# Altium schematic sheet Lora module.SchDoc
size A; SheetNumber: 2; SheetTotal: 3
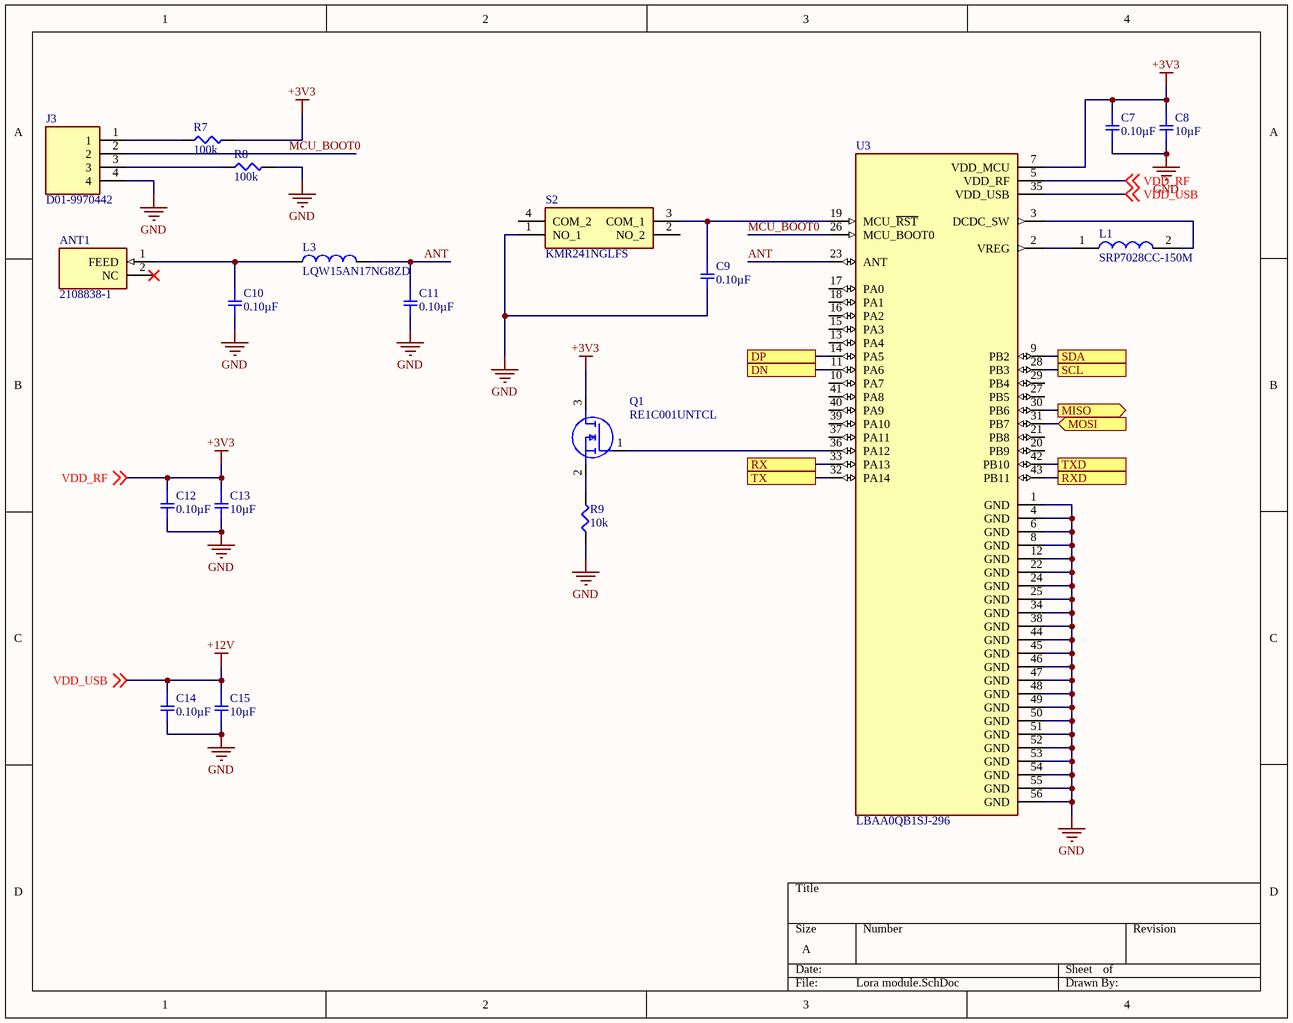
[diagram p0: Lora module.SchDoc]

## Parts
ANT1  2108838-1  [ANTC3216X140N]
C7  0.10µF  [SMD-0402C]
C8  10µF  [SMD-0402C]
C9  0.10µF  [SMD-0402C]
C10  0.10µF  [SMD-0402C]
C11  0.10µF  [SMD-0402C]
C12  0.10µF  [SMD-0402C]
C13  10µF  [SMD-0402C]
C14  0.10µF  [SMD-0402C]
C15  10µF  [SMD-0402C]
J3  D01-9970442  [RHDR4W53P0X254_1X4_1016X246X254P]
L1  SRP7028CC-150M  [INDPM7366X300N]
L3  LQW15AN17NG8ZD  [INDC1006X60N]
Q1  RE1C001UNTCL  [SOTFL50P160X85-3N]
R7  100k  [SMD-0402-RES]
R8  100k  [SMD-0402-RES]
R9  10k  [SMD-0402-RES]
S2  KMR241NGLFS  [KMR241NGLFS]
U3  LBAA0QB1SJ-296  [MODULE_LBAA0QB1SJ-296]

## Ports
DN, DP, MISO (out), MOSI (in), RX, RXD, SCL, SDA, TX, TXD

## Nets
+3V3: C7.1 C8.1 C12.1 C13.1 Q1.3(D) R7.2 U3.5(VDD_RF) U3.7(VDD_MCU) ; off-sheet VDD_RF  [also labelled VDD_RF]
+12V: C14.1 C15.1 U3.35(VDD_USB) ; off-sheet VDD_USB  [also labelled VDD_USB]
GND: C7.2 C8.2 C9.2 C10.2 C11.2 C12.2 C13.2 C14.2 C15.2 J3.4 R8.2 R9.1 S2.1(NO_1) U3.1(GND) U3.4(GND) U3.6(GND) U3.8(GND) U3.12(GND) U3.22(GND) U3.24(GND) U3.25(GND) U3.34(GND) U3.38(GND) U3.44(GND) U3.45(GND) U3.46(GND) U3.47(GND) U3.48(GND) U3.49(GND) U3.50(GND) U3.51(GND) U3.52(GND) U3.53(GND) U3.54(GND) U3.55(GND) U3.56(GND)
ANT: C11.1 L3.2 U3.23(ANT)
DN: U3.11(PA6) ; port DN
DP: U3.14(PA5) ; port DP
MCU_BOOT0: J3.2 U3.26(MCU_BOOT0)
MISO: U3.30(PB6) ; port MISO
MOSI: U3.31(PB7) ; port MOSI
RX: U3.33(PA13) ; port RX
RXD: U3.43(PB11) ; port RXD
SCL: U3.28(PB3) ; port SCL
SDA: U3.9(PB2) ; port SDA
TX: U3.32(PA14) ; port TX
TXD: U3.42(PB10) ; port TXD
NetANT1_1: ANT1.1(FEED) C10.1 L3.1
NetC9_1: C9.1 S2.3(COM_1) U3.19(MCU_~{RST})
NetJ3_1: J3.1 R7.1
NetJ3_3: J3.3 R8.1
NetL1_1: L1.1 U3.2(VREG)
NetL1_2: L1.2 U3.3(DCDC_SW)
NetQ1_1: Q1.1(G) U3.36(PA12)
NetQ1_2: Q1.2(S) R9.2

Not connected (* = marked no-connect by the designer): ANT1 2(NC)*; S2 2(NO_2) 4(COM_2); U3 10(PA7) 13(PA4) 15(PA3) 16(PA2) 17(PA0) 18(PA1) 20(PB9) 21(PB8) 27(PB5) 29(PB4) 37(PA11) 39(PA10) 40(PA9) 41(PA8)

## Library data of the parts
ANT1 = 2108838-1: Antenna; Manufacturer_Name: TE Connectivity; Datasheet Link: https://www.mouser.de/datasheet/2/418/8/ENG_DS_2108838_A1-2509087.pdf; Height: 1.4mm; Manufacturer_Part_Number: 2108838-1; Mouser Part Number: 571-2108838-1; Mouser Price/Stock: https://www.mouser.co.uk/ProductDetail/TE-Connectivity/2108838-1?qs=pBJMDPsKWf2GaqEOsIISlQ%3D%3D; Arrow Part Number: 2108838-1; Arrow Price/Stock: https://www.arrow.com/en/products/2108838-1/te-connectivity?region=europe
C7 C9-C12 C14 = GCM155R71C104KA55D: CAP CER 0.1UF 16V X7R 0402; Manufacturer: Murata Electronics North America; Factory Stock: 0; Unit Price (USD): 0.1; Minimum Quantity: 1; Tolerance: ±10%; Datasheets: http://www.murata.com/~/media/webrenewal/support/library/catalog/products/capacitor/mlcc/c03e.ashx; Image: //media.digikey.com/Renders/Murata%20Renders/ZRB-SERIES-0402.jpg; Digi-Key Part Number: 490-4759-1-ND; Part Number: GCM155R71C104KA55D; Quantity Available: 734194; @ qty: 0; Packaging: Cut Tape (CT); Series: GCM; Part Status: Active; Value: 0.10µF; Voltage: 16V; Temperature Coefficient: X7R; Operating Temperature: -55°C ~ 125°C; Features: -; Ratings: AEC-Q200; Applications: Automotive; Mounting Type: Surface Mount, MLCC; Package / Case: 0402 (1005 Metric); Size / Dimension: 0.039" L x 0.020" W (1.00mm x 0.50mm); Height - Seated (Max): -; Thickness (Max): 0.022" (0.55mm); Lead Spacing: -; Lead Style: -
C8 C13 C15 = GRJ155R60J106ME11D: CAP CER 10UF 6.3V X5R 0402; Manufacturer: Murata Electronics North America; Factory Stock: 0; Unit Price (USD): 0.23; Minimum Quantity: 1; Tolerance: ±20%; Datasheets: http://psearch.en.murata.com/capacitor/product/GRJ155R60J106ME11%23.pdf; Image: //media.digikey.com/Renders/Murata%20Renders/ZRB-SERIES-0402.jpg; Digi-Key Part Number: 490-13211-1-ND; Part Number: GRJ155R60J106ME11D; Quantity Available: 64064; @ qty: 0; Packaging: Cut Tape (CT); Series: GRJ; Part Status: Active; Value: 10µF; Voltage: 6.3V; Temperature Coefficient: X5R; Operating Temperature: -55°C ~ 85°C; Features: Derating Recommended, Soft Termination; Ratings: -; Applications: Boardflex Sensitive; Mounting Type: Surface Mount, MLCC; Package / Case: 0402 (1005 Metric); Size / Dimension: 0.039" L x 0.020" W (1.00mm x 0.50mm); Height - Seated (Max): -; Thickness (Max): 0.028" (0.70mm); Lead Spacing: -; Lead Style: -
J3 = D01-9970442: Connector; Manufacturer_Name: Harwin; Datasheet Link: https://cdn.harwin.com/pdfs/D01-997.pdf; Height: 2.54mm; Manufacturer_Part_Number: D01-9970442; Mouser Part Number: 855-D01-9970442; Mouser Price/Stock: https://www.mouser.co.uk/ProductDetail/Harwin/D01-9970442?qs=ecHgFjcWJS%252BUW8IMx%252Bcpow%3D%3D
L1 = SRP7028CC-150M: Inductor; Manufacturer_Name: Bourns; Datasheet Link: https://www.bourns.com/docs/Product-Datasheets/SRP7028CC.pdf; Height: 3mm; Manufacturer_Part_Number: SRP7028CC-150M
L3 = LQW15AN17NG8ZD: FIXED IND 17NH 1A 126 MOHM; MF: {'manufacturer': u'Murata'}; Package: None; Price: None; Value: *; MP: LQW15AN17NG8ZD; Availability: Unavailable
Q1 = RE1C001UNTCL: MOSFET (N-Channel); Manufacturer_Name: ROHM Semiconductor; Datasheet Link: https://datasheet.datasheetarchive.com/originals/distributors/Datasheets_SAMA/a252995f86c5e28cb0f632a782a2eea5.pdf; Height: 0.85mm; Manufacturer_Part_Number: RE1C001UNTCL; Mouser Part Number: 755-RE1C001UNTCL; Mouser Price/Stock: https://www.mouser.co.uk/ProductDetail/ROHM-Semiconductor/RE1C001UNTCL?qs=QcFhgjUTvvoqHeGWcl8O5g%3D%3D
R7 R8 = ERJ-2GEJ104X: RES SMD 100K OHM 5% 1/10W 0402; Manufacturer: Panasonic Electronic Components; Factory Stock: 0; Unit Price (USD): 0.00350; @ qty: 1500; Minimum Quantity: 1; Power (Watts): 0.1W, 1/10W; Temperature Coefficient: ±200ppm/°C; Part Number: ERJ-2GEJ104X; Datasheets: http://industrial.panasonic.com/www-cgi/jvcr13pz.cgi?E+PZ+3+AOA0001+ERJ2GEJ104X+7+WW; Image: //media.digikey.com/Photos/Panasonic%20Photos/ERJ-PA2-Series.jpg; Digi-Key Part Number: P100KJCT-ND; Quantity Available: 2387986; Packaging: Cut Tape (CT); Series: ERJ; Part Status: Active; Value: 100k; Tolerance: ±5%; Composition: Thick Film; Features: Automotive AEC-Q200; Operating Temperature: -55°C ~ 155°C; Package / Case: 0402 (1005 Metric); Supplier Device Package: 0402; Size / Dimension: 0.039" L x 0.020" W (1.00mm x 0.50mm); Height - Seated (Max): 0.016" (0.40mm); Number of Terminations: 2; Failure Rate: -
R9 = ERJ-2GEJ103X: RES SMD 10K OHM 5% 1/10W 0402; Manufacturer: Panasonic Electronic Components; Factory Stock: 0; Unit Price (USD): 0.00350; @ qty: 1500; Minimum Quantity: 1; Power (Watts): 0.1W, 1/10W; Temperature Coefficient: ±200ppm/°C; Part Number: ERJ-2GEJ103X; Datasheets: http://industrial.panasonic.com/www-cgi/jvcr13pz.cgi?E+PZ+3+AOA0001+ERJ2GEJ103X+7+WW; Image: //media.digikey.com/Photos/Panasonic%20Photos/ERJ-PA2-Series.jpg; Digi-Key Part Number: P10KJCT-ND; Quantity Available: 2560215; Packaging: Cut Tape (CT); Series: ERJ; Part Status: Active; Value: 10k; Tolerance: ±5%; Composition: Thick Film; Features: Automotive AEC-Q200; Operating Temperature: -55°C ~ 155°C; Package / Case: 0402 (1005 Metric); Supplier Device Package: 0402; Size / Dimension: 0.039" L x 0.020" W (1.00mm x 0.50mm); Height - Seated (Max): 0.016" (0.40mm); Number of Terminations: 2; Failure Rate: -
S2 = KMR241NGLFS: Switch; Manufacturer_Name: C & K COMPONENTS; Datasheet Link: https://www.ckswitches.com/media/1479/kmr2.pdf; Height: 1.9mm; Manufacturer_Part_Number: KMR241NGLFS; Mouser Part Number: 611-KMR241NGLFS; Mouser Price/Stock: https://www.mouser.co.uk/ProductDetail/CK/KMR241NGLFS?qs=sb%252But3Lm4x3MOq2auuFbeg%3D%3D; Arrow Part Number: KMR241NGLFS; Arrow Price/Stock: https://www.arrow.com/en/products/kmr241nglfs/ck
U3 = LBAA0QB1SJ-296: RF Modules Type 1SJ 868/915MHz PCB Whip Flex Ant; MF: {'manufacturer': u'Murata Electronics'}; Package: None; Price: None; Value: *; MP: LBAA0QB1SJ-296; Availability: Unavailable